# EAGLE schematic skematik relay (EAGLE 7.1.0)
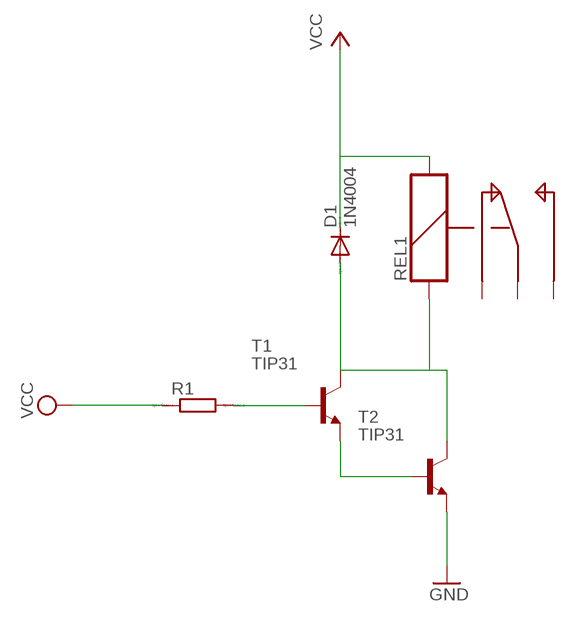
[diagram p0: schematic, sheet 1]

## Parts
D1  1N4004  [DO41-10]
R1  R-EU_0204_5  [0204/5]
REL1  REL-5PIN  [REL-5PIN]
T1  TIP31  [TO220]
T2  TIP31  [TO220]

## Nets
GND: T2.3(E)
N$1: R1.2 T1.1(B)
N$2: T1.3(E) T2.1(B)
N$3: D1.A REL1.S1 T1.2(C) T2.2(C)
VCC: D1.C R1.1 REL1.S2
Unconnected: REL1.C REL1.O REL1.S

## Library data of the parts
D1 = diode:1N4004: DIODE general purpose rectifier, 1 A
R1 = resistor:R-EU_: RESISTOR, European symbol; SPICEPREFIX: R
REL1 = special:REL-5PIN: RELAY
T1 T2 = transistor:TIP31: NPN Transistor Medium Power Linear Switching Applications Source: http://onsemi.com